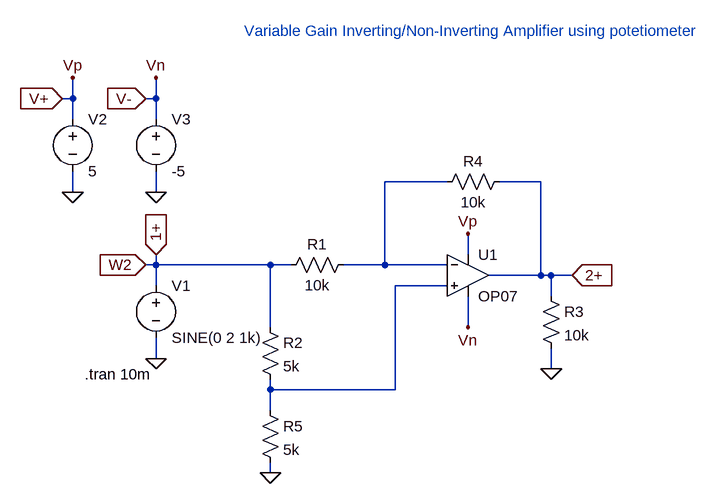
[diagram p0: schematic var_gain_inv_noninv_amp_pot.asc]
var_gain_inv_noninv_amp_pot.asc, the LTspice schematic file:
Version 4
SHEET 1 880 680
WIRE -240 16 -240 -16
WIRE -240 16 -256 16
WIRE -112 16 -112 -16
WIRE -112 16 -128 16
WIRE -240 48 -240 16
WIRE -112 48 -112 16
WIRE 336 144 240 144
WIRE 480 144 416 144
WIRE -240 160 -240 128
WIRE -112 160 -112 128
WIRE 368 256 368 224
WIRE -112 272 -112 256
WIRE -112 272 -128 272
WIRE 64 272 -112 272
WIRE 96 272 64 272
WIRE 240 272 240 144
WIRE 240 272 176 272
WIRE 336 272 240 272
WIRE 480 288 480 144
WIRE 480 288 400 288
WIRE 496 288 480 288
WIRE 528 288 496 288
WIRE -112 304 -112 272
WIRE 336 304 256 304
WIRE 496 320 496 288
WIRE 64 368 64 272
WIRE 368 368 368 320
WIRE -112 416 -112 384
WIRE 496 432 496 400
WIRE 64 464 64 448
WIRE 256 464 256 304
WIRE 256 464 64 464
WIRE 64 496 64 464
WIRE 64 592 64 576
FLAG 64 592 0
FLAG -112 416 0
FLAG 496 432 0
FLAG 368 224 Vp
FLAG 368 368 Vn
FLAG -240 160 0
FLAG -112 160 0
FLAG -240 -16 Vp
FLAG -112 -16 Vn
FLAG -256 16 V+
IOPIN -256 16 In
FLAG -128 16 V-
IOPIN -128 16 In
FLAG -128 272 W2
IOPIN -128 272 In
FLAG 528 288 2+
IOPIN 528 288 In
FLAG -112 256 1+
IOPIN -112 256 In
SYMBOL res 192 256 R90
WINDOW 0 0 56 VBottom 2
WINDOW 3 32 56 VTop 2
SYMATTR InstName R1
SYMATTR Value 10k
SYMBOL voltage -112 288 R0
WINDOW 123 0 0 Left 0
WINDOW 39 0 0 Left 0
SYMATTR InstName V1
SYMATTR Value SINE(0 2 1k)
SYMBOL res 480 304 R0
SYMATTR InstName R3
SYMATTR Value 10k
SYMBOL voltage -240 32 R0
WINDOW 123 0 0 Left 0
WINDOW 39 0 0 Left 0
SYMATTR InstName V2
SYMATTR Value 5
SYMBOL voltage -112 32 R0
WINDOW 123 0 0 Left 0
WINDOW 39 0 0 Left 0
SYMATTR InstName V3
SYMATTR Value -5
SYMBOL Opamps\\OP07 368 224 R0
SYMATTR InstName U1
SYMBOL res 432 128 R90
WINDOW 0 0 56 VBottom 2
WINDOW 3 32 56 VTop 2
SYMATTR InstName R4
SYMATTR Value 10k
SYMBOL res 48 352 R0
SYMATTR InstName R2
SYMATTR Value 5k
SYMBOL res 48 480 R0
SYMATTR InstName R5
SYMATTR Value 5k
TEXT -222 440 Left 2 !.tran 10m
TEXT 24 -88 Left 2 ;Variable Gain Inverting/Non-Inverting Amplifier using potetiometer

The netlist it stands for:
* var_gain_inv_noninv_amp_pot.asc
R1 N001 1+ 10k
V1 1+ 0 SINE(0 2 1k)
R3 2+ 0 10k
V2 V+ 0 5
V3 V- 0 -5
XU1 N002 N001 V+ V- 2+ LT1001  ; OP07, pins In+ In- V+ V- OUT
R4 2+ N001 10k
R2 1+ N002 5k
R5 N002 0 5k
.tran 10m
* Variable Gain Inverting/Non-Inverting Amplifier using potetiometer
.lib LTC.lib
.backanno
.end